# EAGLE design PEC16 edge (EAGLE 6.5.0)
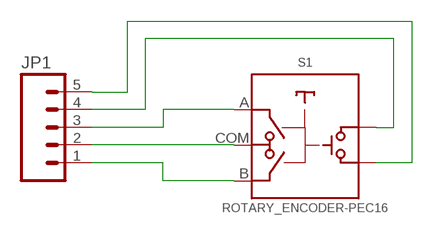
[diagram p0: schematic, sheet 1]

## Parts
JP1  M05PTH  [1X05]
S1  ROTARY_ENCODER-PEC16  [PEC16-2XXX]

## Nets
N$1: JP1.4 S1.P$4
N$2: JP1.5 S1.P$5
N$3: JP1.3 S1.A
N$4: JP1.2 S1.COM
N$5: JP1.1 S1.B

## Library data of the parts
JP1 = SparkFun-Connectors:M05: Header 5 Standard 5-pin 0.1" header. Use with straight break away headers (SKU : PRT-00116), right angle break away headers (PRT-00553), swiss pins (PRT-00743), machine pins (PRT-00117), and female headers (PRT-00115). Molex polarized connector foot print use with SKU : PRT-08230 with associated crimp pins and housings.
S1 = ChipsParts:ROTARY_ENCODER: Rotary Encoder with push-button switch. Bourns PEC-16 right-angle mount. DigiKey # PEC16-2215F-S0024-ND TT Electronics EN12 right-angle mount. Digikey # 987-1198-ND

## Board
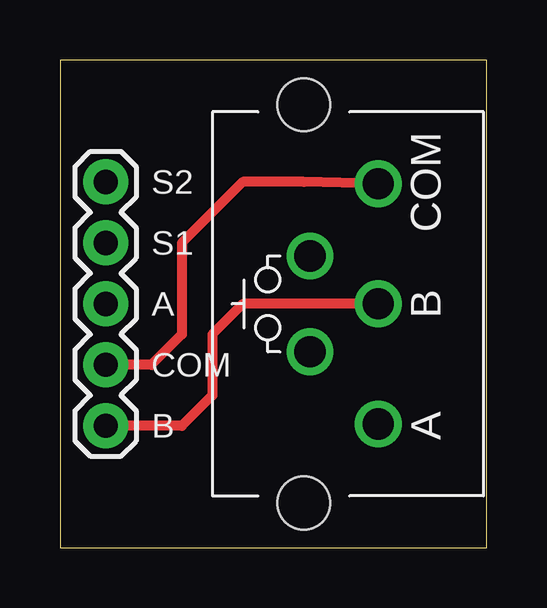
[diagram p1: board, top side]
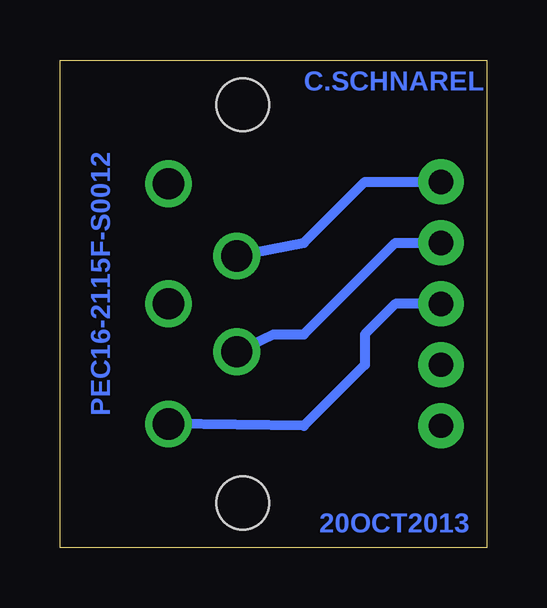
[diagram p2: board, bottom side, seen from below]

Size 17.78 x 20.32 mm. Coordinates in mm from the lower left corner, seen from the top.
Outline: 0,0 17.78,0 17.78,20.32 0,20.32 0,0
Copper layers (1*16): Top 0.0356mm / dielectric 1.5011mm / Bottom 0.0356mm
Design rules "LaenPCBOrder": minimum track width 6mil, minimum drill 13mil, track to track 6mil, track to pad 6mil, pad to pad 6mil, via to via 6mil, smd to smd 6mil, copper to edge 15mil, drill to drill 6mil, minimum pad ring 7mil, minimum via ring 7mil, stop-mask expansion 4mil, vias tented up to drill 0mil, thermal gap 10mil

### Footprints (pad centres in the part's own frame; a part is rotated, then mirrored left to right if it is on the bottom)
1X05 = drill 1.016 pad 1.88: 1 0,0; 2 2.54,0; 3 5.08,0; 4 7.62,0; 5 10.16,0
PEC16-2XXX = drill 1.3: A -5.004,-3.099; B 0,-3.099; COM 5.004,-3.099; P$4 -1.994,-0.254; P$5 1.994,-0.254 | hole 2.2: -8.301,0; 8.301,0

### Placement (x,y rotation side)
JP1  1.91,5.08 90 top
S1  10.16,10.16 90 top

### Tracks (layer width: path | path; a pad name or v marks a point on that pad's centre or on a via)
N$1
  Bottom 0.406: S1.P$4 8.89,8.89 7.62,8.89 3.81,12.7 JP1.4
N$2
  Bottom 0.406: S1.P$5 7.62,12.7 5.08,15.24 JP1.5
N$3
  Bottom 0.406: JP1.3 3.81,10.16 5.08,8.89 5.08,7.62 7.62,5.08 S1.A
N$4
  Top 0.406: S1.COM 10.16,15.24 7.62,15.24 5.08,12.7 5.08,8.89 3.81,7.62 JP1.2
N$5
  Top 0.406: S1.B 7.62,10.16 6.35,8.89 6.35,6.35 5.08,5.08 JP1.1

### Text on the board
Bottom: C.SCHNAREL | PEC16-2115F-S0012 | 20OCT2013
tPlace: S2 | S1 | A | COM | B